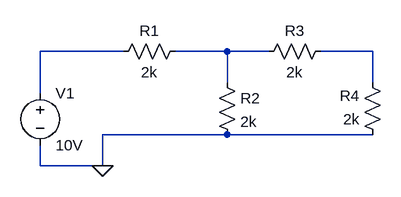
[diagram p0: schematic prelab circuit.asc]
prelab circuit.asc, the LTspice schematic file:
Version 4
SHEET 1 880 680
WIRE 192 48 64 48
WIRE 352 48 272 48
WIRE 416 48 352 48
WIRE 576 48 496 48
WIRE 352 96 352 48
WIRE 576 96 576 48
WIRE 64 112 64 48
WIRE 352 176 160 176
WIRE 576 176 352 176
WIRE 64 224 64 192
WIRE 160 224 160 176
WIRE 160 224 64 224
FLAG 160 224 0
SYMBOL voltage 64 96 R0
WINDOW 123 0 0 Left 0
WINDOW 39 0 0 Left 0
SYMATTR InstName V1
SYMATTR Value 10V
SYMBOL res 288 32 R90
WINDOW 0 0 56 VBottom 2
WINDOW 3 32 56 VTop 2
SYMATTR InstName R1
SYMATTR Value 2k
SYMBOL res 336 80 R0
SYMATTR InstName R2
SYMATTR Value 2k
SYMBOL res 512 32 R90
WINDOW 0 0 56 VBottom 2
WINDOW 3 32 56 VTop 2
SYMATTR InstName R3
SYMATTR Value 2k
SYMBOL res 592 192 R180
WINDOW 0 36 76 Left 2
WINDOW 3 36 40 Left 2
SYMATTR InstName R4
SYMATTR Value 2k

The netlist it stands for:
* prelab circuit.asc
V1 N001 0 10V
R1 N002 N001 2k
R2 N002 0 2k
R3 N003 N002 2k
R4 0 N003 2k
.backanno
.end